# EasyEDA schematic easyeda_schematic.json
TITLE: Millivolt Meter; REV: 1.0; Date: 2018-01-17; Sheet: 1/1; Drawn By: tardate
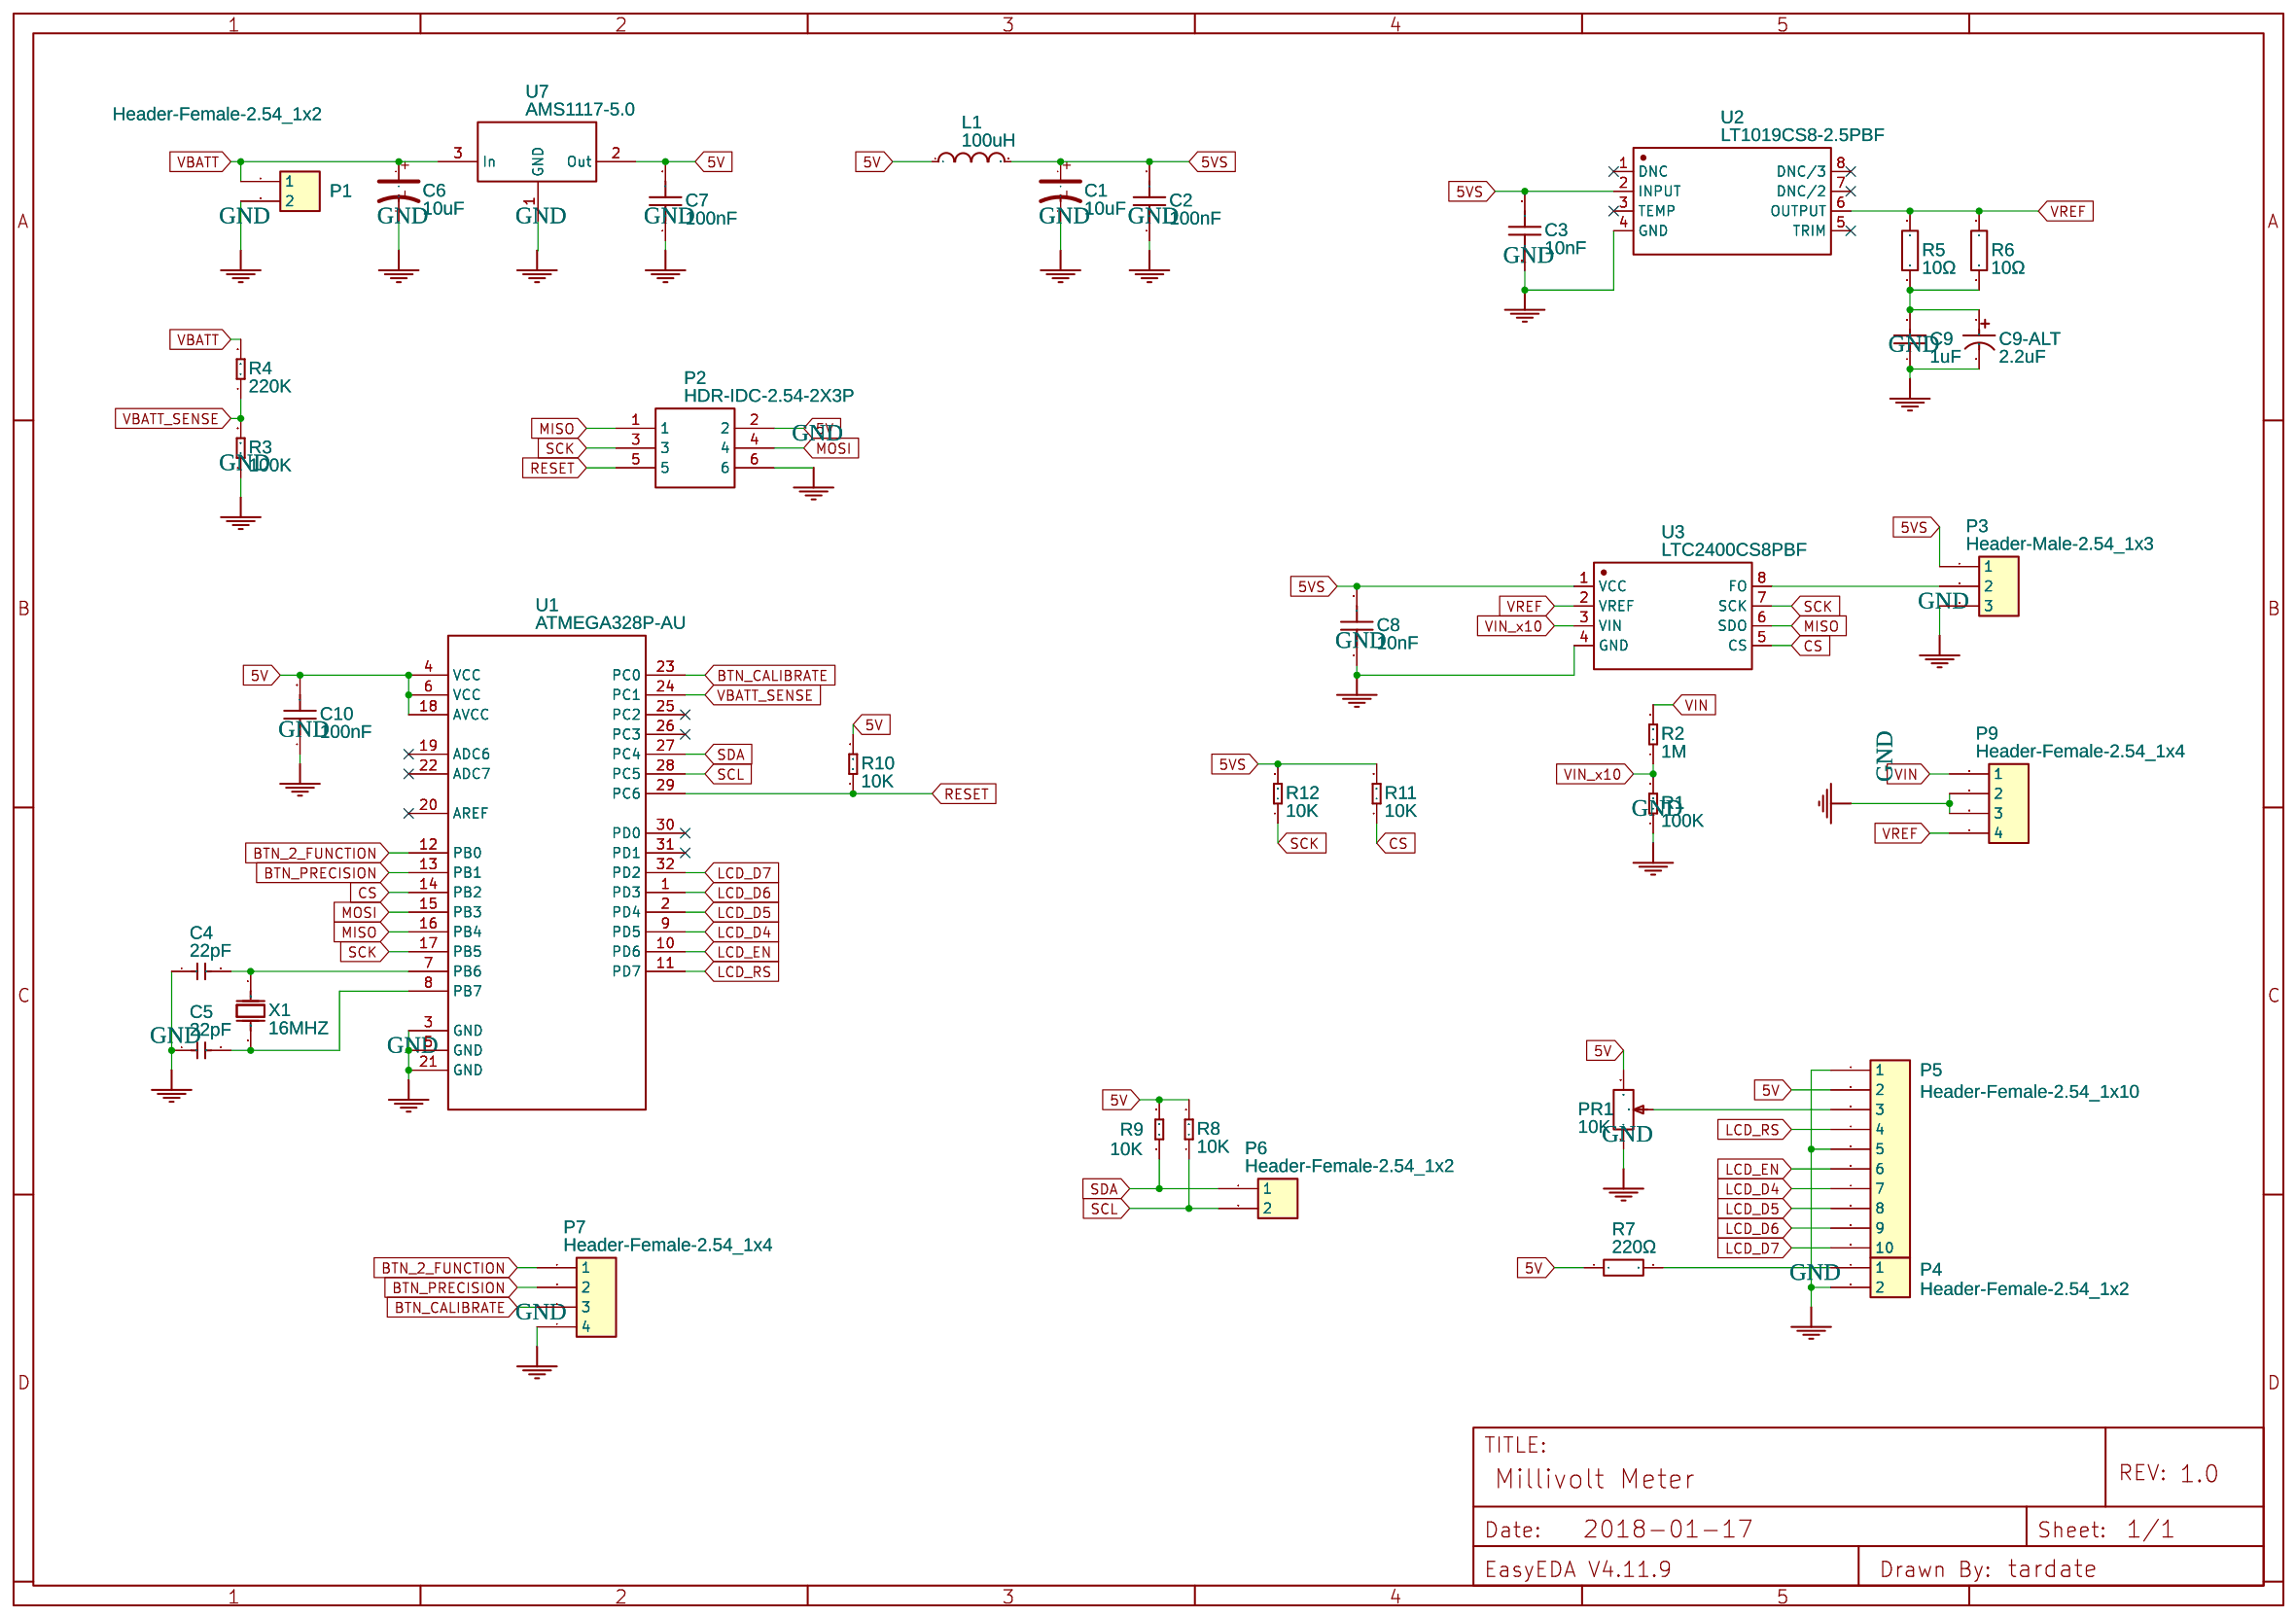
[diagram p0: schematic sheet]

## Parts
C1  10uF  [ELECTRO-SMD-A-3.8MM]
C2  100nF  [0805]
C3  10nF  [0805]
C4  22pF  [C0805]
C5  22pF  [C0805]
C6  10uF  [ELECTRO-SMD-A-3.8MM]
C7  100nF  [0805]
C8  10nF  [0805]
C9  1uF  [0805]
C9-ALT  2.2uF  [CAP-D5.0XF2.0]
C10  100nF  [0805]
L1  100uH  [0805]
P1  Header-Female-2.54_1x2  [HDR-1X2/2.54]
P2  HDR-IDC-2.54-2X3P  [HDR-IDC-2.54-2X3P]
P3  Header-Male-2.54_1x3  [HDR-3X1/2.54]
P4  Header-Female-2.54_1x2  [HDR-1X2/2.54]
P5  Header-Female-2.54_1x10  [HDR-10X1/2.54]
P6  Header-Female-2.54_1x2  [HDR-1X2/2.54]
P7  Header-Female-2.54_1x4  [HDR-4X1/2.54]
P9  Header-Female-2.54_1x4  [HDR-4X1/2.54]
PR1  10K  [RM065-V1]
R1  100K  [R0805]
R2  1M  [R0805]
R3  100K  [R0805]
R4  220K  [R0805]
R5  10Ω  [0805]
R6  10Ω  [0805]
R7  220Ω  [0805]
R8  10K  [R0805]
R9  10K  [R0805]
R10  10K  [R0805]
R11  10K  [R0805]
R12  10K  [R0805]
U1  ATMEGA328P-AU  [TQFP-32_7X7X08P]
U2  LT1019CS8-2.5PBF  [SOIC-8]
U3  LTC2400CS8PBF  [SOIC-8]
U7  AMS1117-5.0  [SOT-223]
X1  16MHZ  [OSC-49S-1]

## Library data of the parts
C1 C6 = -: SMD CAP Aluminum 10UF 20% 16V; catid: 20; Manufacturer Part: UWX1C100MCL1GB
C2 C7 C10 = -: Voltage: 50V; Tolerance: ±5%; Supplier: LCSC; Manufacturer: YAGEO; Manufacturer Part: CC0805JRX7R9BB103; LCSC: C58456
C3 C8 = -: Voltage: 50V; Tolerance: ±10%; Supplier: LCSC; Manufacturer: YAGEO; Manufacturer Part: CC0805KRX7R9BB103; LCSC: C83170
C4 C5 = -: SMD CAP Ceramic 22pF-50V-5%-NPO; catid: 20; Manufacturer Part: CC0805JRNPO9BN220
C9 = -: Voltage: 50V; Tolerance: ±10%; Supplier: LCSC; Manufacturer: FH; Manufacturer Part: 0805B105K500NT; LCSC: C29822
C9-ALT = -: Voltage: 50V; Supplier: LCSC; Manufacturer: ValuePro; Manufacturer Part: 2.2uF 50V 5*11; LCSC: C43343
L1 = -: Tolerance: ±10%; Supplier: LCSC; Manufacturer Part: MLF2012C101KT000; LCSC: C68035; LCSC Assembly: Yes; Manufacturer: TDK
P1 P4 P6 = -: LCSC: C49661; Supplier: LCSC; Manufacturer: LCSC
P2 = -: LCSC: C11214; Supplier: LCSC; Manufacturer: LCSC
P3 = -: LCSC: C49257; Supplier: LCSC; Manufacturer: LCSC
P5 = -: LCSC: C35445; Supplier: LCSC; Manufacturer: LCSC
P7 P9 = -: LCSC: C44527; Supplier: LCSC; Manufacturer: LCSC
PR1 = -: Tolerance: ±25%; Supplier: LCSC; Manufacturer: ReliaPro; Manufacturer Part: RM065-V1-103; LCSC: C54661
R1 R3 = -: SMD RES 100K-1%-1/8W; catid: 20; Manufacturer Part: RC0805FR-07100KL
R2 = -: SMD RES 1M-5%-1/8W;; catid: 20; Manufacturer Part: RC0805JR-071ML
R4 = -: SMD RES 220K-5%-1/8W;; catid: 20; Manufacturer Part: RC0603JR-07220KL
R5 R6 = -: Power: 1/8W; Tolerance: ±5%; Supplier: LCSC; Manufacturer: UniOhm; Manufacturer Part: 0805W8J0100T5E; LCSC: C25278
R7 = -: Power: 1/8W; Tolerance: ±5%; Supplier: LCSC; Manufacturer: UniOhm; Manufacturer Part: 0805W8J0221T5E; LCSC: C25294
R8-R12 = -: SMD RES 10K-1%-1/8W; catid: 20; Manufacturer Part: RC0805FR-0710KL
U1 = -: catid: 20; Supplier: LCSC; Manufacturer: ATMEL; LCSC: C14877
U2 U3 = -: Manufacturer Part: ?
U7 = -: sourceId: HltLFyQwq; Supplier: LCSC; Manufacturer: AMS; LCSC: C6187; LCSC Assembly: Yes
X1 = -: Supplier: LCSC; Manufacturer: YXC; Manufacturer Part: X49SD16MSD2SC; LCSC: C16212

## Nets
5V: C7.2 C10.2 L1.1 P2.2 P5.2 PR1.3 R7.1 R8.2 R9.2 R10.2 U1.4(VCC) U1.6(VCC) U1.18(AVCC) U7.2(Out)
5VS: C1.+ C2.2 C3.2 C8.2 L1.2 P3.1 R11.2 R12.2 U2.2(INPUT) U3.1(VCC)
GND: C1.- C2.1 C3.1 C4.1 C5.1 C6.- C7.1 C8.1 C9.1 C9-ALT.2 C10.1 P1.2 P2.6 P3.3 P4.2 P5.1 P5.5 P7.4 P9.2 P9.3 PR1.1 R1.1 R3.1 U1.3(GND) U1.5(GND) U1.21(GND) U2.4(GND) U3.4(GND) U7.1(GND)
VBATT: C6.+ P1.1 R4.2 U7.3(In)
VBATT_SENSE: R3.2 R4.1 U1.24(PC1)
VIN: P9.1 R2.2
VIN_x10: R1.2 R2.1 U3.3(VIN)
BTN_2_FUNCTION: P7.1 U1.12(PB0)
BTN_CALIBRATE: P7.3 U1.23(PC0)
BTN_PRECISION: P7.2 U1.13(PB1)
CS: R11.1 U1.14(PB2) U3.5(CS)
LCD_D4: P5.7 U1.9(PD5)
LCD_D5: P5.8 U1.2(PD4)
LCD_D6: P5.9 U1.1(PD3)
LCD_D7: P5.10 U1.32(PD2)
LCD_EN: P5.6 U1.10(PD6)
LCD_RS: P5.4 U1.11(PD7)
MISO: P2.1 U1.16(PB4) U3.6(SDO)
MOSI: P2.4 U1.15(PB3)
RESET: P2.5 R10.1 U1.29(PC6)
SCK: P2.3 R12.1 U1.17(PB5) U3.7(SCK)
SCL: P6.2 R8.1 U1.28(PC5)
SDA: P6.1 R9.1 U1.27(PC4)
VREF: P9.4 R5.2 R6.2 U2.6(OUTPUT) U3.2(VREF)
Net-(C9-2): C9.2 C9-ALT.1 R5.1 R6.1
PR1_2: P5.3 PR1.2
R7_2: P4.1 R7.2
U1_7: C4.2 U1.7(PB6) X1.1(OSC1)
U1_8: C5.2 U1.8(PB7) X1.2(OSC2)
U3_8: P3.2 U3.8(FO)

Not connected (* = marked no-connect by the designer): U1 19(ADC6)* 20(AREF)* 22(ADC7)* 25(PC2)* 26(PC3)* 30(PD0)* 31(PD1)*; U2 1(DNC)* 3(TEMP)* 5(TRIM)* 7(DNC/2)* 8(DNC/3)*
